# EAGLE design amp1_v0001 (EAGLE 6.4)
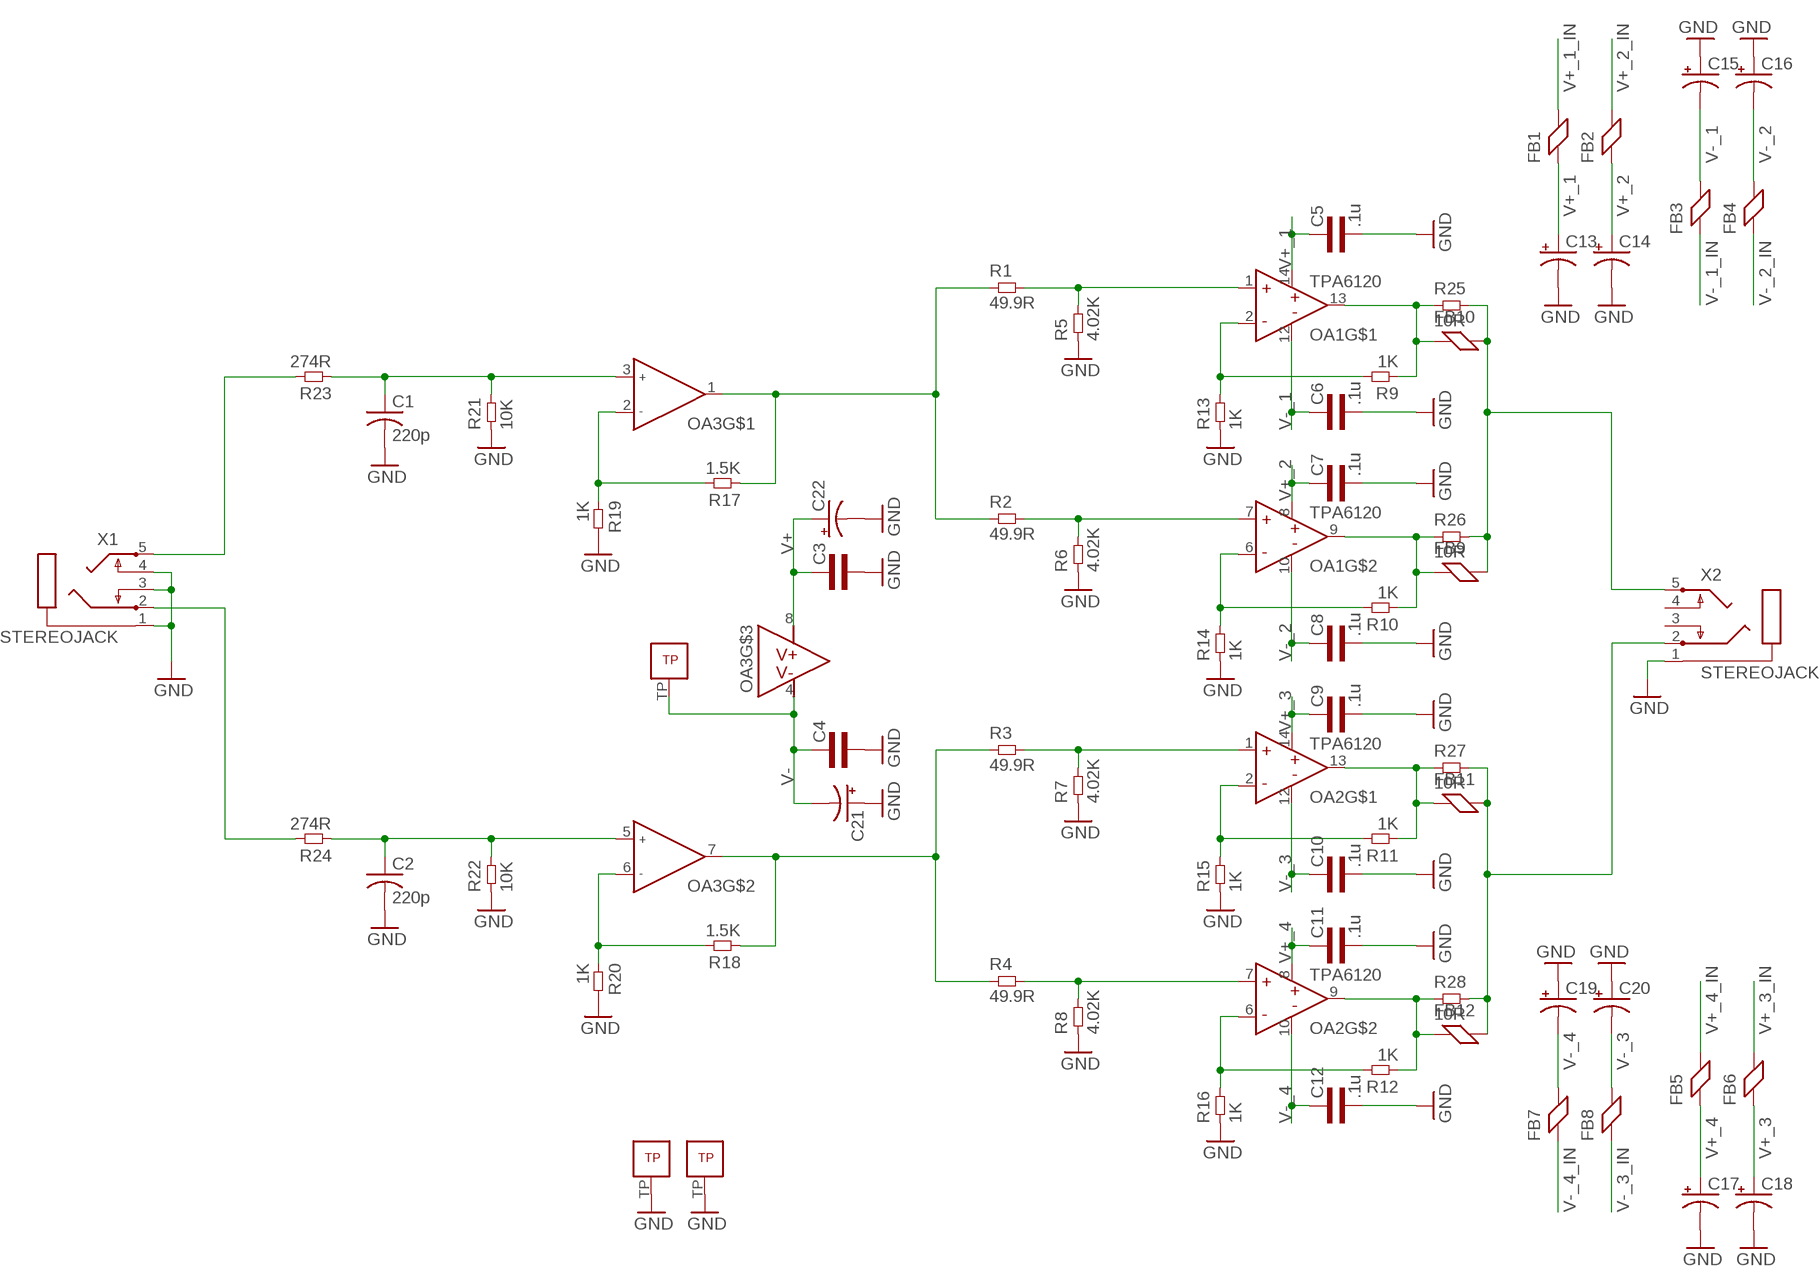
[diagram p0: schematic, sheet 1]

## Parts
C1  220p  C-US025-025X050  [C025-025X050]
C2  220p  C-US025-025X050  [C025-025X050]
C3  CAP0603L3  [0603L3]
C4  CAP0603L3  [0603L3]
C5  .1u  CAP0603L3  [0603L3]
C6  .1u  CAP0603L3  [0603L3]
C7  .1u  CAP0603L3  [0603L3]
C8  .1u  CAP0603L3  [0603L3]
C9  .1u  CAP0603L3  [0603L3]
C10  .1u  CAP0603L3  [0603L3]
C11  .1u  CAP0603L3  [0603L3]
C12  .1u  CAP0603L3  [0603L3]
C13  CPOL-USE2-5  [E2-5]
C14  CPOL-USE2-5  [E2-5]
C15  CPOL-USE2-5  [E2-5]
C16  CPOL-USE2-5  [E2-5]
C17  CPOL-USE2-5  [E2-5]
C18  CPOL-USE2-5  [E2-5]
C19  CPOL-USE2-5  [E2-5]
C20  CPOL-USE2-5  [E2-5]
C21  CPOL-USE2-5  [E2-5]
C22  CPOL-USE2-5  [E2-5]
FB1  FERRITE0805L3  [0805L3]
FB2  FERRITE0805L3  [0805L3]
FB3  FERRITE0805L3  [0805L3]
FB4  FERRITE0805L3  [0805L3]
FB5  FERRITE0805L3  [0805L3]
FB6  FERRITE0805L3  [0805L3]
FB7  FERRITE0805L3  [0805L3]
FB8  FERRITE0805L3  [0805L3]
FB9  FERRITE0805L3  [0805L3]
FB10  FERRITE0805L3  [0805L3]
FB11  FERRITE0805L3  [0805L3]
FB12  FERRITE0805L3  [0805L3]
OA1  TPA6120QFN  [S-PVQFN-N14]
OA2  TPA6120QFN  [S-PVQFN-N14]
OA3  OPA1612  [S-PWSON-N8]
R1  49.9R  RES0805L3  [0805L3]
R2  49.9R  RES0805L3  [0805L3]
R3  49.9R  RES0805L3  [0805L3]
R4  49.9R  RES0805L3  [0805L3]
R5  4.02K  RES0805L3  [0805L3]
R6  4.02K  RES0805L3  [0805L3]
R7  4.02K  RES0805L3  [0805L3]
R8  4.02K  RES0805L3  [0805L3]
R9  1K  RES0805L3  [0805L3]
R10  1K  RES0805L3  [0805L3]
R11  1K  RES0805L3  [0805L3]
R12  1K  RES0805L3  [0805L3]
R13  1K  RES0805L3  [0805L3]
R14  1K  RES0805L3  [0805L3]
R15  1K  RES0805L3  [0805L3]
R16  1K  RES0805L3  [0805L3]
R17  1.5K  RES0805L3  [0805L3]
R18  1.5K  RES0805L3  [0805L3]
R19  1K  RES0805L3  [0805L3]
R20  1K  RES0805L3  [0805L3]
R21  10K  RES0805L3  [0805L3]
R22  10K  RES0805L3  [0805L3]
R23  274R  RES0805L3  [0805L3]
R24  274R  RES0805L3  [0805L3]
R25  10R  RES1206L3  [1206L3]
R26  10R  RES1206L3  [1206L3]
R27  10R  RES1206L3  [1206L3]
R28  10R  RES1206L3  [1206L3]
X1  STEREOJACK  [STX3100]
X2  STEREOJACK  [STX3100]

## Nets
GND: C1.2 C2.2 C3.P$2 C4.P$2 C5.P$2 C6.P$2 C7.P$2 C8.P$2 C9.P$2 C10.P$2 C11.P$2 C12.P$2 C13.- C14.- C15.+ C16.+ C17.- C18.- C19.+ C20.+ C21.+ C22.- OA1.TP OA2.TP R5.1 R6.1 R7.1 R8.1 R13.1 R14.1 R15.1 R16.1 R19.2 R20.2 R21.1 R22.1 X1.1 X1.3 X1.4 X2.1
N$1: OA1.1(IN+) R1.2 R5.2
N$2: OA1.7(IN+) R2.2 R6.2
N$3: OA2.1(IN+) R3.2 R7.2
N$4: OA2.7(IN+) R4.2 R8.2
N$5: FB11.1 OA2.13(OUT) R11.1 R27.1
N$6: FB12.1 OA2.9(OUT) R12.1 R28.1
N$7: FB9.1 OA1.9(OUT) R10.1 R26.1
N$8: FB10.1 OA1.13(OUT) R9.1 R25.1
N$9: OA1.2(IN-) R9.2 R13.2
N$10: OA1.6(IN-) R10.2 R14.2
N$11: OA2.2(IN-) R11.2 R15.2
N$12: OA2.6(IN-) R12.2 R16.2
N$13: FB9.2 FB10.2 R25.2 R26.2 X2.5
N$14: OA3.1(OUTA) R1.1 R2.1 R17.1
N$15: FB11.2 FB12.2 R27.2 R28.2 X2.2
N$16: OA3.7(OUTB) R3.1 R4.1 R18.1
N$17: OA3.6(INB-) R18.2 R20.1
N$18: OA3.2(INA-) R17.2 R19.1
N$19: C1.1 OA3.3(INA+) R21.2 R23.1
N$20: C2.1 OA3.5(INB+) R22.2 R24.1
N$23: R24.2 X1.2
N$24: R23.2 X1.5
V+: C3.P$1 C22.+ OA3.8(V+)
V+_1: C5.P$1 C13.+ FB1.1 OA1.14(V+)
V+_1_IN: FB1.2
V+_2: C7.P$1 C14.+ FB2.1 OA1.8(V+)
V+_2_IN: FB2.2
V+_3: C9.P$1 C18.+ FB6.1 OA2.14(V+)
V+_3_IN: FB6.2
V+_4: C11.P$1 C17.+ FB5.1 OA2.8(V+)
V+_4_IN: FB5.2
V-: C4.P$1 C21.- OA3.4(V-) OA3.TP
V-_1: C6.P$1 C15.- FB3.2 OA1.12(V-)
V-_1_IN: FB3.1
V-_2: C8.P$1 C16.- FB4.2 OA1.10(V-)
V-_2_IN: FB4.1
V-_3: C10.P$1 C20.- FB8.2 OA2.12(V-)
V-_3_IN: FB8.1
V-_4: C12.P$1 C19.- FB7.2 OA2.10(V-)
V-_4_IN: FB7.1
Unconnected: X2.3 X2.4

## Library data of the parts
C1 C2 = rcl:C-US: CAPACITOR, American symbol
C3-C12 = common:CAP
C13-C22 = rcl:CPOL-US: POLARIZED CAPACITOR, American symbol
FB1-FB12 = common:FERRITE
OA1 OA2 = common:TPA6120
OA3 = common:OPA1612
R1-R28 = common:RES
X1 X2 = adafruit:STEREOJACK: MIC/HEADPHONE JACK Stereo jack with two switches. Kycon STX3100, CUI SJ1-3555NG and/or 4UCon 05544

## Board
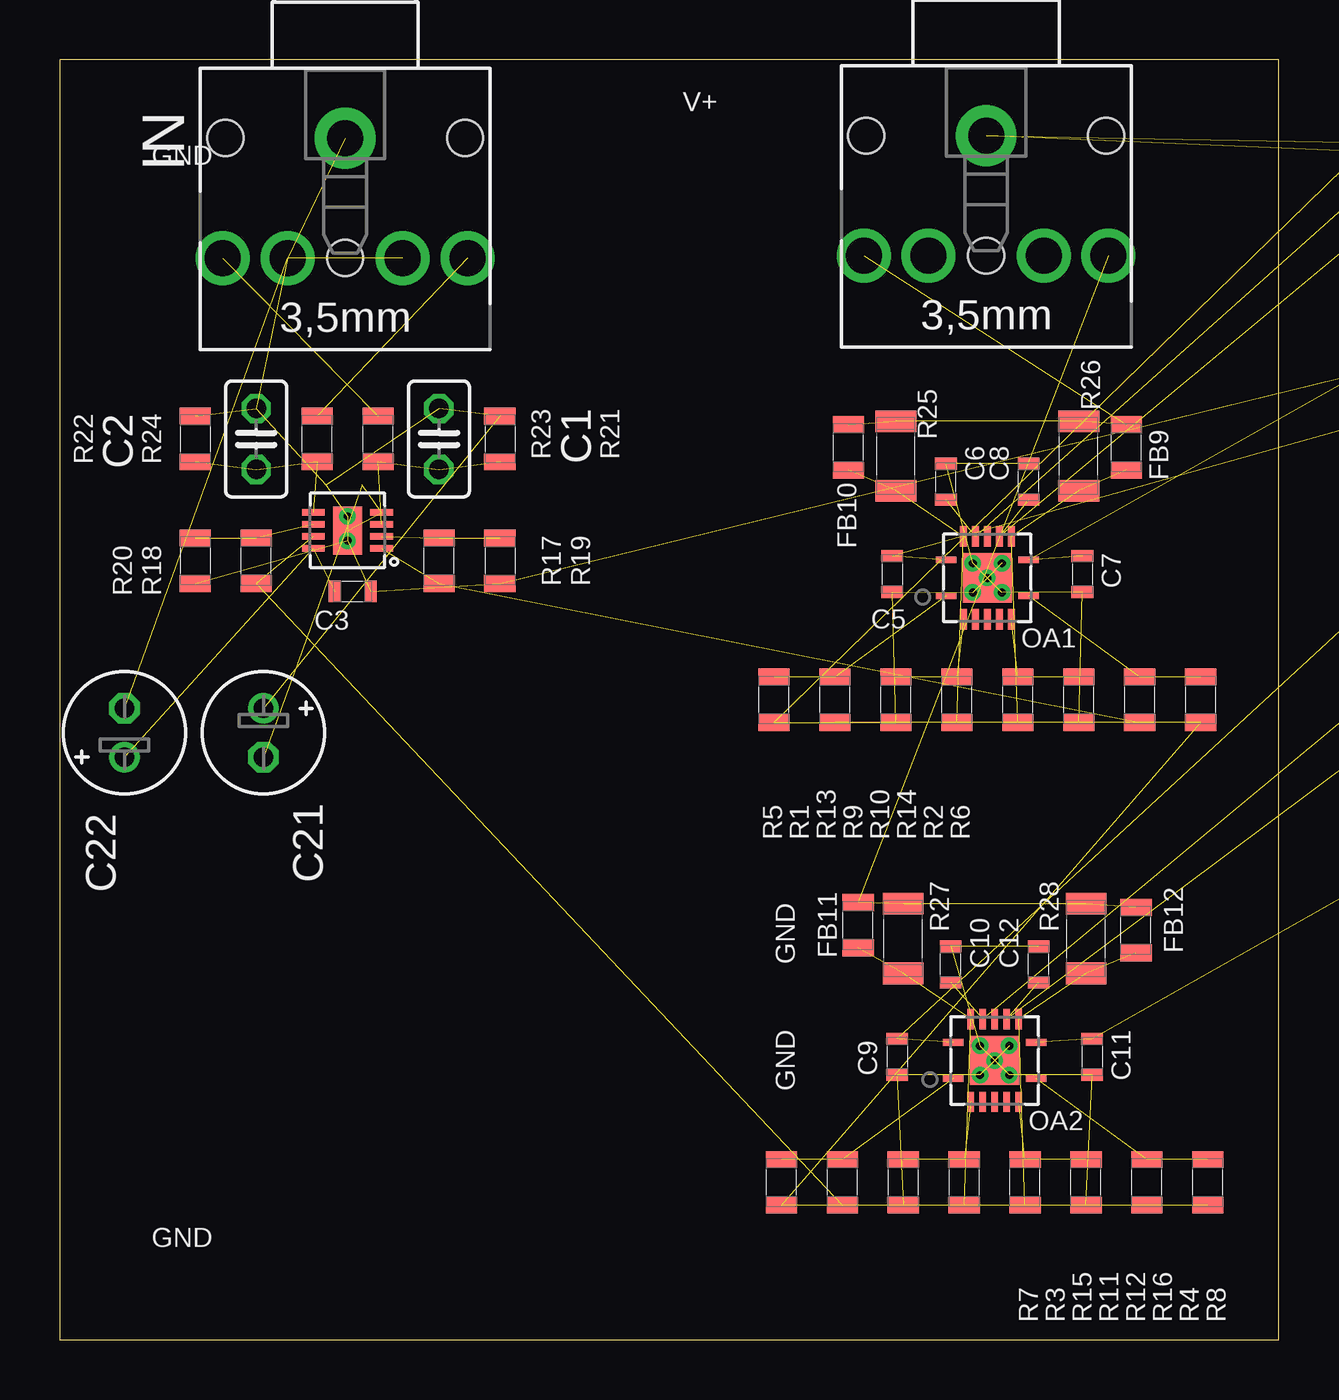
[diagram p1: board, top side]
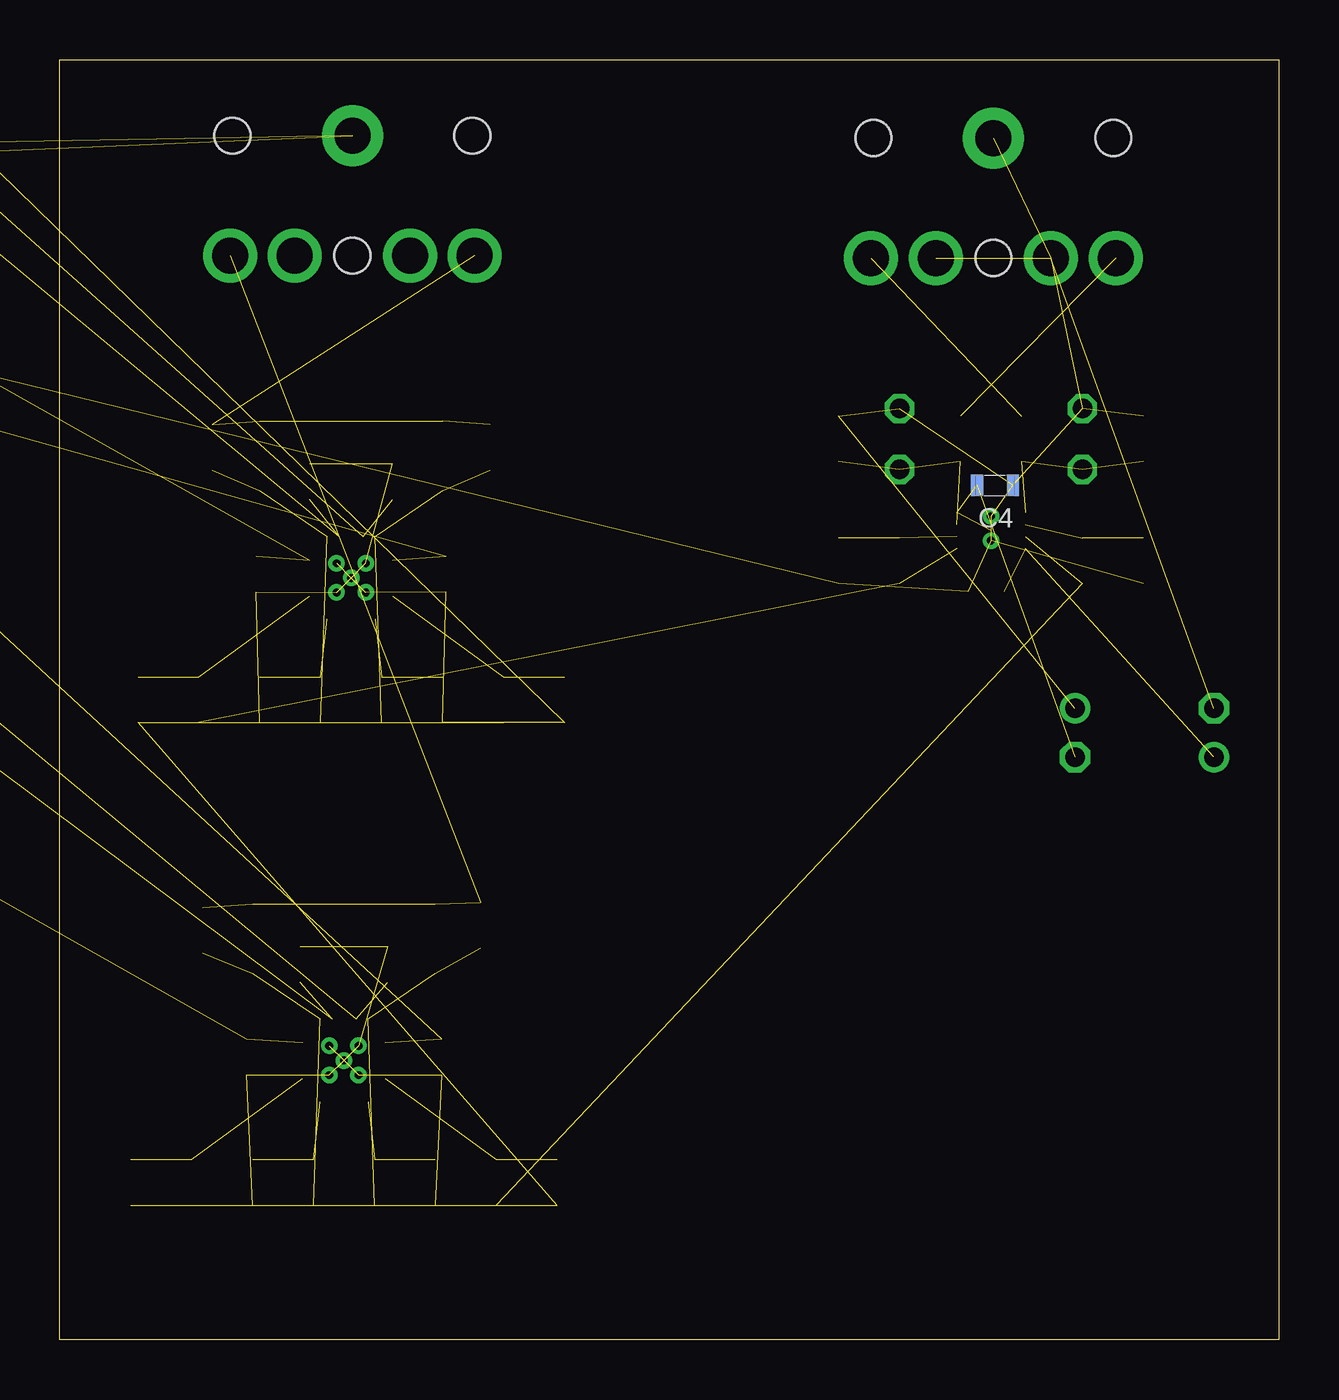
[diagram p2: board, bottom side, seen from below]

Size 50.8 x 53.34 mm. Coordinates in mm from the lower left corner, seen from the top.
Outline: 0,0 50.8,0 50.8,53.34 0,53.34 0,0
Copper layers (1*16): Top 0.035mm / dielectric 1.5mm / Bottom 0.035mm
Design rules "default *": minimum track width 8mil, minimum drill 13mil, track to track 8mil, track to pad 8mil, pad to pad 8mil, via to via 8mil, smd to smd 8mil, copper to edge 16mil, drill to drill 8mil, minimum pad ring 7mil, minimum via ring 7mil, stop-mask expansion 4mil, vias tented up to drill 0mil, thermal gap 10mil

### Footprints (pad centres in the part's own frame; a part is rotated, then mirrored left to right if it is on the bottom)
C025-025X050 = drill 0.813 octagon: 1 -1.27,0; 2 1.27,0
0603L3 = smd 0.5 x 0.9: P$1 -0.75,0; P$2 0.75,0
E2-5 = drill 0.813 pad 1.27: + -1.016,0 | drill 0.813 pad 1.27 octagon: - 1.016,0
0805L3 = smd 0.7 x 1.3: 1 -0.95,0; 2 0.95,0
S-PVQFN-N14 = smd 0.85 x 0.28: 1 -1.725,-0.75; 7 1.725,-0.75; 8 1.725,0.75; 14 -1.725,0.75 | smd 0.28 x 0.85: 2 -1,-1.725; 3 -0.5,-1.725; 4 0,-1.725; 5 0.5,-1.725; 6 1,-1.725; 9 1,1.725; 10 0.5,1.725; 11 0,1.725; 12 -0.5,1.725; 13 -1,1.725 | smd 2.05 x 2.05: TP 0,0
S-PWSON-N8 = smd 0.28 x 0.95: 1 -0.75,-1.425; 2 -0.25,-1.425; 3 0.25,-1.425; 4 0.75,-1.425; 5 0.75,1.425; 6 0.25,1.425; 7 -0.25,1.425; 8 -0.75,1.425 | smd 2 x 1.2: TP 0,0
1206L3 = smd 0.9 x 1.7: 1 -1.45,0; 2 1.45,0
STX3100 = drill 1.5 pad 2.54: 1 2.7,-0.1 | drill 1.5: 2 7.7,5; 3 7.7,2.3; 4 7.7,-2.5; 5 7.7,-5.2 | hole 1.5: 2.7,4.9; 2.7,-5.1; 7.7,-0.1

### Placement (x,y rotation side)
C1  15.8,37.54 90 top
C2  8.18,37.54 90 top
C3  12.19,31.19 0 top
C4  11.84,35.61 0 bottom
C5  34.7,31.9 270 top
C6  36.93,35.76 90 top
C7  42.62,31.9 270 top
C8  40.39,35.76 90 top
C9  34.9,11.79 270 top
C10  37.13,15.65 90 top
C11  43.03,11.79 270 top
C12  40.79,15.65 90 top
C13  58.12,40.23 90 top  (outside the outline)
C14  70.82,48.49 90 top  (outside the outline)
C15  58.12,52.3 270 top  (outside the outline)
C16  64.47,48.49 180 top  (outside the outline)
C17  90.22,40.23 90 top  (outside the outline)
C18  77.52,48.49 0 top  (outside the outline)
C19  90.22,52.3 270 top  (outside the outline)
C20  83.87,48.49 180 top  (outside the outline)
C21  8.48,25.3 270 top
C22  2.69,25.3 90 top
FB1  60.66,36.42 270 bottom  (outside the outline)
FB2  68.28,49.12 90 bottom  (outside the outline)
FB3  56.21,49.76 90 bottom  (outside the outline)
FB4  60.66,52.3 270 bottom  (outside the outline)
FB5  87.68,36.42 270 bottom  (outside the outline)
FB6  74.98,50.39 90 bottom  (outside the outline)
FB7  87.68,49.12 0 bottom  (outside the outline)
FB8  81.97,50.39 270 bottom  (outside the outline)
FB9  44.45,37.19 90 top
FB10  32.87,37.19 90 top
FB11  33.27,17.27 90 top
FB12  44.86,17.07 90 top
OA1  38.66,31.75 0 top
OA2  38.96,11.63 0 top
OA3  11.99,33.73 90 top
R1  32.31,26.67 90 top
R2  45.01,26.67 90 top
R3  32.61,6.55 90 top
R4  45.31,6.55 90 top
R5  29.77,26.67 90 top
R6  47.55,26.67 90 top
R7  30.07,6.55 90 top
R8  47.85,6.55 90 top
R9  37.39,26.67 90 top
R10  39.93,26.67 90 top
R11  37.69,6.55 90 top
R12  40.23,6.55 90 top
R13  34.85,26.67 90 top
R14  42.47,26.67 90 top
R15  35.15,6.55 90 top
R16  42.77,6.55 90 top
R17  15.8,32.46 90 top
R18  8.18,32.46 90 top
R19  18.34,32.46 270 top
R20  5.64,32.46 270 top
R21  18.34,37.54 270 top
R22  5.64,37.54 270 top
R23  13.26,37.54 90 top
R24  10.72,37.54 90 top
R25  34.85,36.83 90 top
R26  42.47,36.83 90 top
R27  35.15,16.71 90 top
R28  42.77,16.71 90 top
X1  11.99,52.78 270 top
X2  38.71,52.88 270 top

### Tracks (layer width: path | path; a pad name or v marks a point on that pad's centre or on a via)
GND  (via drill 0.33, 0.33 pad 0.51)  (50 unrouted)
  other vias: 38.05,31.14 38.35,11.02 72.49,49.58 38.05,32.36 38.66,31.75 39.27,31.14 39.27,32.36 38.35,12.24 38.96,11.63 39.57,11.02 39.57,12.24 11.99,34.32 11.99,33.3
N$1  (2 unrouted)
N$2  (2 unrouted)
N$3  (2 unrouted)
N$4  (2 unrouted)
N$5  (3 unrouted)
N$6  (3 unrouted)
N$7  (3 unrouted)
N$8  (3 unrouted)
N$9  (2 unrouted)
N$10  (2 unrouted)
N$11  (2 unrouted)
N$12  (2 unrouted)
N$13  (4 unrouted)
N$14  (3 unrouted)
N$15  (4 unrouted)
N$16  (3 unrouted)
N$17  (2 unrouted)
N$18  (2 unrouted)
N$19  (3 unrouted)
N$20  (3 unrouted)
N$23  (1 unrouted)
N$24  (1 unrouted)
V+  (2 unrouted)
V+_1  (3 unrouted)
V+_2  (3 unrouted)
V+_3  (3 unrouted)
V+_4  (3 unrouted)
V-  (3 unrouted)
V-_1  (3 unrouted)
V-_2  (3 unrouted)
V-_3  (3 unrouted)
V-_4  (3 unrouted)

### Text on the board
tNames: V+ | IN | V+ | GND | GND | GND | GND